# Altium schematic sheet POWER_SUPPLY.SchDoc: SG Sensor
size B; DocumentNumber: 5; SheetNumber: 2; SheetTotal: 4; PAGE_TITLE: Power Supply
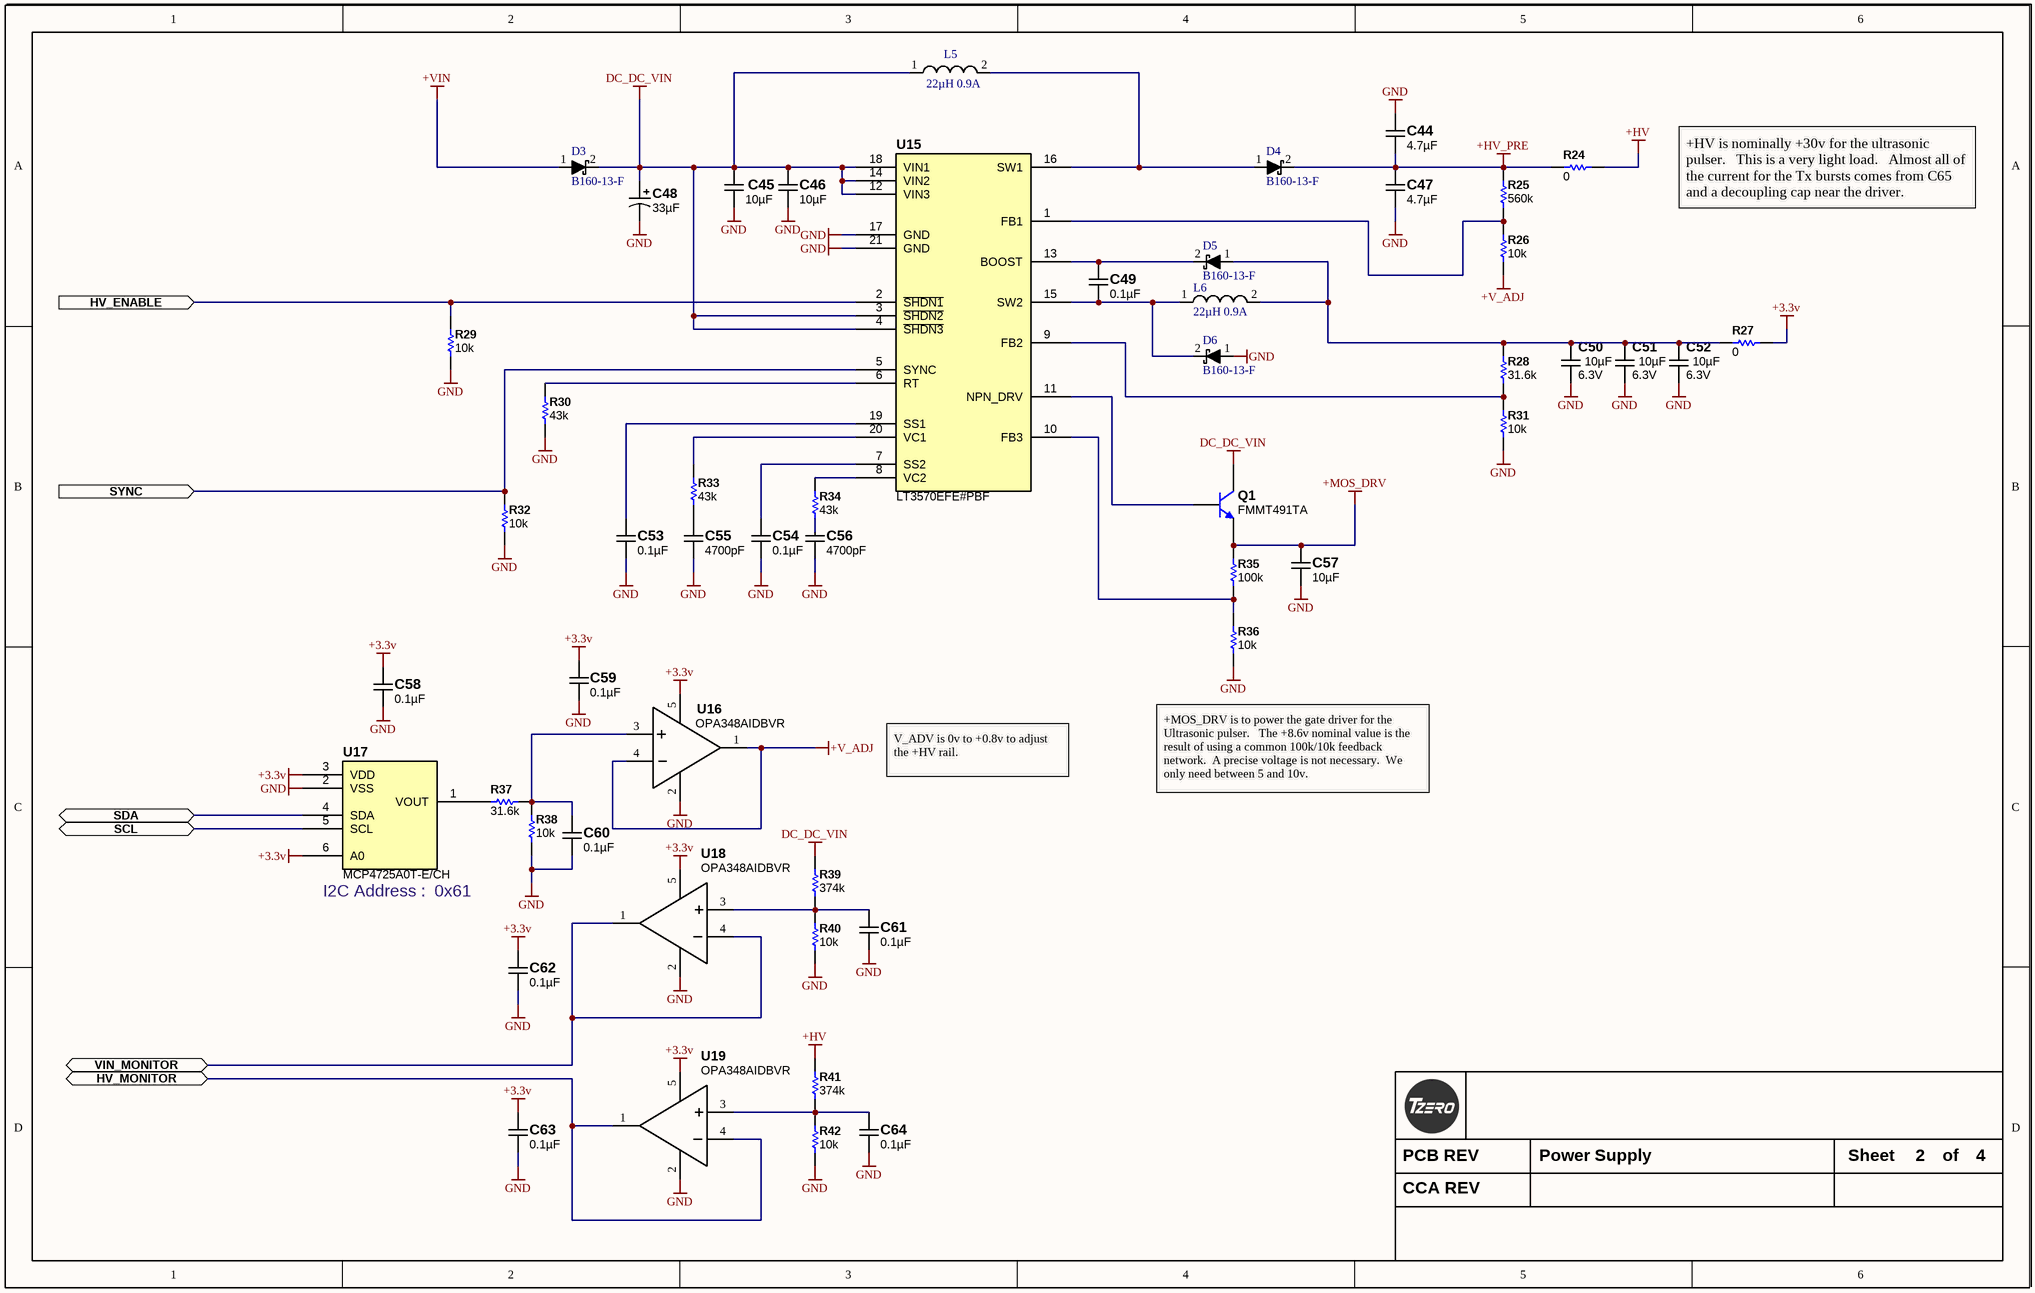
[diagram p0: POWER_SUPPLY.SchDoc]

## Parts
C44  4.7µF  [C1210_2.80MM_HD]
C45  10µF  [C1206_1.90MM_HD]
C46  10µF  [C1206_1.90MM_HD]
C47  4.7µF  [C1210_2.80MM_HD]
C48  33µF  [C_ALU_C]
C49  0.1µF  [C0603_0.90MM_HD]
C50  10µF  Voltage - Rated: 6.3V  [C0805_1.45MM_MD]
C51  10µF  Voltage - Rated: 6.3V  [C0805_1.45MM_MD]
C52  10µF  Voltage - Rated: 6.3V  [C0805_1.45MM_MD]
C53  0.1µF  [C0603_0.90MM_HD]
C54  0.1µF  [C0603_0.90MM_HD]
C55  4700pF  [C0603_0.95MM_HD]
C56  4700pF  [C0603_0.95MM_HD]
C57  10µF  [C1206_1.90MM_HD]
C58  0.1µF  [C0603_0.90MM_HD]
C59  0.1µF  [C0603_0.90MM_HD]
C60  0.1µF  [C0603_0.90MM_HD]
C61  0.1µF  [C0603_0.90MM_HD]
C62  0.1µF  [C0603_0.90MM_HD]
C63  0.1µF  [C0603_0.90MM_HD]
C64  0.1µF  [C0603_0.90MM_HD]
D3  B160-13-F  [D_SMA_P]
D4  B160-13-F  [D_SMA_P]
D5  B160-13-F  [D_SMA_P]
D6  B160-13-F  [D_SMA_P]
L5  22µH 0.9A  [L_NRS5020]
L6  22µH 0.9A  [L_NRS5020]
Q1  FMMT491TA  [SOT-23]
R24  0  [R0603_0.55MM_HD]
R25  560k  [R0603_0.55MM_HD]
R26  10k  [R0603_0.55MM_HD]
R27  0  [R0603_0.55MM_HD]
R28  31.6k  [R0603_0.55MM_HD]
R29  10k  [R0603_0.55MM_HD]
R30  43k  [R0603_0.55MM_HD]
R31  10k  [R0603_0.55MM_HD]
R32  10k  [R0603_0.55MM_HD]
R33  43k  [R0603_0.55MM_HD]
R34  43k  [R0603_0.55MM_HD]
R35  100k  [R0603_0.55MM_HD]
R36  10k  [R0603_0.55MM_HD]
R37  31.6k  [R0603_0.55MM_HD]
R38  10k  [R0603_0.55MM_HD]
R39  374k  [R0603_0.55MM_HD]
R40  10k  [R0603_0.55MM_HD]
R41  374k  [R0603_0.55MM_HD]
R42  10k  [R0603_0.55MM_HD]
U15  LT3570EFE#PBF  [TSOP65P640X120_HS-21N]
U16  OPA348AIDBVR  [SOT23-5]
U17  MCP4725A0T-E/CH  [SOT95P245X145-6L]
U18  OPA348AIDBVR  [SOT23-5]
U19  OPA348AIDBVR  [SOT23-5]

## Ports
HV_ENABLE (in), HV_MONITOR (bidir), SCL (bidir), SDA (bidir), SYNC (in), VIN_MONITOR (bidir)

## Nets
+3.3v: C58.2 C59.2 C62.2 C63.2 R27.1 U16.5(VCC) U17.3(VDD) U17.6(A0) U18.5(VCC) U19.5(VCC)
+HV: R24.1 R41.2
+HV_PRE: C44.1 C47.2 D4.2(K) R24.2 R25.2
+MOS_DRV: C57.2 Q1.2(E) R35.2
+V_ADJ: R26.1 U16.1(OUT) U16.4(-)
+VIN: D3.1(A)
DC_DC_VIN: C45.2 C46.2 C48.1 D3.2(K) L5.1 Q1.3(C) R39.2 U15.3(~{SHDN2}) U15.4(~{SHDN3}) U15.12(VIN3) U15.14(VIN2) U15.18(VIN1)
GND: C44.2 C45.1 C46.1 C47.1 C48.2 C50.1 C51.1 C52.1 C53.1 C54.1 C55.1 C56.1 C57.1 C58.1 C59.1 C60.1 C61.1 C62.1 C63.1 C64.1 D6.1(A) R29.1 R30.1 R31.1 R32.1 R36.1 R38.1 R40.1 R42.1 U15.17(GND) U15.21(GND) U16.2(GND) U17.2(VSS) U18.2(GND) U19.2(GND)
HV_ENABLE: R29.2 U15.2(~{SHDN1}) ; port HV_ENABLE
HV_MONITOR: U19.1(OUT) U19.4(-) ; port HV_MONITOR
SCL: U17.5(SCL) ; port SCL
SDA: U17.4(SDA) ; port SDA
SYNC: R32.2 U15.5(SYNC) ; port SYNC
VIN_MONITOR: U18.1(OUT) U18.4(-) ; port VIN_MONITOR
NetC49_1: C49.1 D6.2(K) L6.1 U15.15(SW2)
NetC49_2: C49.2 D5.2(K) U15.13(BOOST)
NetC50_2: C50.2 C51.2 C52.2 D5.1(A) L6.2 R27.2 R28.2
NetC53_2: C53.2 U15.19(SS1)
NetC54_2: C54.2 U15.7(SS2)
NetC55_2: C55.2 R33.1
NetC56_2: C56.2 R34.1
NetC60_2: C60.2 R37.1 R38.2 U16.3(+)
NetC61_2: C61.2 R39.1 R40.2 U18.3(+)
NetC64_2: C64.2 R41.1 R42.2 U19.3(+)
NetD4_1: D4.1(A) L5.2 U15.16(SW1)
NetQ1_1: Q1.1(B) U15.11(NPN_DRV)
NetR25_1: R25.1 R26.2 U15.1(FB1)
NetR28_1: R28.1 R31.2 U15.9(FB2)
NetR30_2: R30.2 U15.6(RT)
NetR33_2: R33.2 U15.20(VC1)
NetR34_2: R34.2 U15.8(VC2)
NetR35_1: R35.1 R36.2 U15.10(FB3)
NetR37_2: R37.2 U17.1(VOUT)

## Notes on the sheet
- +HV is nominally +30v for the ultrasonic pulser.   This is a very light load.   Almost all of the current for the Tx bursts comes from C65 and a decoupling cap near the driver.
- V_ADV is 0v to +0.8v to adjust the +HV rail.
- (near R36) +MOS_DRV is to power the gate driver for the Ultrasonic pulser.   The +8.6v nominal value is the result of using a common 100k/10k feedback network.  A precise voltage is not necessary.  We only need between 5 and 10v.
- (near U17) I2C Address :  0x61
- PCB REV
- Sheet
- of
- CCA REV

## Library data of the parts
C44 C47 = CGA6P3X7R1H475M250AB: CAP CER 4.7UF 50V X7R 1210; Manufacturer: TDK Corporation; Tolerance: ±20%; Substitution Notes: 4.7µF , 50V , ±20% , X7R , -55°C ~ 125°C , AEC-Q200 , 1210; Value: 4.7µF; Temperature Coefficient: X7R; Manufacturer Part Number: CGA6P3X7R1H475M250AB; ComponentLink1Description: Datasheet (Internal); ComponentLink1URL: datasheets\TDK\mlcc_automotive_general_en.pdf; ComponentLink2Description: Datasheet (External); ComponentLink2URL: https://product.tdk.com/info/en/catalog/datasheets/mlcc_automotive_general_en.pdf; Supplier 1: Digikey; Supplier Part Number 1: 445-13030-1-ND; Category: Capacitors; Voltage - Rated: 50V; Operating Temperature: -55°C ~ 125°C; Ratings: AEC-Q200; Package: 1210; Thickness (Max): 2.80MM; Features: -
C45 C46 C57 = CGA5L1X7R1V106K160AE: CAP CER 10UF 35V X7R 1206; Manufacturer: TDK Corporation; Tolerance: ±10%; Substitution Notes: 10µF , 35V , ±10% , X7R , -55°C ~ 125°C , AEC-Q200 , 1206; Value: 10µF; Temperature Coefficient: X7R; Manufacturer Part Number: CGA5L1X7R1V106K160AE; ComponentLink1Description: Datasheet (Internal); ComponentLink1URL: datasheets\TDK\mlcc_automotive_general_en.pdf; ComponentLink2Description: Datasheet (External); ComponentLink2URL: https://product.tdk.com/info/en/catalog/datasheets/mlcc_automotive_general_en.pdf; Supplier 1: Digikey; Supplier Part Number 1: 445-172483-1-ND; Category: Capacitors; Voltage - Rated: 35V; Operating Temperature: -55°C ~ 125°C; Ratings: AEC-Q200; Package: 1206; Thickness (Max): 1.90MM; Features: Soft Termination
C48 = EEE-FK1E330UR: CAP ALUM 33UF 25V 20% SMD; Manufacturer: Panasonic Electronic Components; Lifetime @ Temp#: 2000 Hrs @ 105°C; Ripple Current: 160mA; Impedance: 700 mOhm; Surface Mount Land Size: 0.209" L x 0.209" W (5.30mm x 5.30mm); F40: UR; Value_Voltage: 33µF  25V; Value: 33µF; Temperature Coefficient: Temperature Coefficient; Manufacturer Part Number: EEE-FK1E330UR; ComponentLink1Description: Internal Datasheet; ComponentLink1URL: http://industrial.panasonic.com/www-cgi/jvcr13pz.cgi?E+PZ+3+ABA0120+EEEFK1E330UR+7+WW; ComponentLink2Description: External Datasheet; ComponentLink2URL: http://industrial.panasonic.com/www-cgi/jvcr13pz.cgi?E+PZ+3+ABA0120+EEEFK1E330UR+7+WW; Stocked: 0; Supplier 1: Digi-Key; Supplier Part Number 1: PCE3802CT-ND; Category: Capacitors; Sort Value: 33000000; Sort Value Package: C_33000000; Pricing: 1 = 0.63  ;  50 = 0.3576  ;  100 = 0.298  ;  250 = 0.22348  ;  500 = 0.19072 (USD); Sales Status: Active; Capacitance: 33µF; Voltage Rating: 25V; Tolerance: ±20%; Operating Temperature: -55°C ~ 105°C; Features: General Purpose; ESR (Equivalent Series Resistance): -; Mounting Type: Surface Mount; Package / Case: Radial- Can - SMD; Size / Dimension: 0.197" Dia (5.00mm); Height - Seated (Max): 0.228" (5.80mm); Lead Spacing: -; Packaging: Cut Tape (CT); Diameter: 5.00; Height: 5.80; Package: C
C49 C53 C54 C58-C64 = CGA3E2X7R1H104K080AE: CAP CER 0.1UF 50V X7R 0603; Manufacturer: TDK Corporation; Tolerance: ±10%; Substitution Notes: 0.1µF , 50V , ±10% , X7R , -55°C ~ 125°C , AEC-Q200 , 0603; Value: 0.1µF; Temperature Coefficient: X7R; Manufacturer Part Number: CGA3E2X7R1H104K080AE; ComponentLink1Description: Datasheet (Internal); ComponentLink1URL: datasheets\TDK\mlcc_automotive_general_en.pdf; ComponentLink2Description: Datasheet (External); ComponentLink2URL: https://product.tdk.com/info/en/catalog/datasheets/mlcc_automotive_general_en.pdf; Supplier 1: Digikey; Supplier Part Number 1: 445-15957-1-ND; Category: Capacitors; Voltage - Rated: 50V; Operating Temperature: -55°C ~ 125°C; Ratings: AEC-Q200; Package: 0603; Thickness (Max): 0.90MM; Features: Soft Termination
C50-C52 = CGA4J1X7R0J106K125AC: CAP CER 10UF 6.3V X7R 0805; Manufacturer: TDK Corporation; Tolerance: ±10%; Substitution Notes: 10µF , 6.3V , ±10% , X7R , -55°C ~ 125°C , AEC-Q200 , 0805; Value: 10µF; Temperature Coefficient: X7R; Manufacturer Part Number: CGA4J1X7R0J106K125AC; ComponentLink1Description: Datasheet (Internal); ComponentLink1URL: datasheets\TDK\mlcc_automotive_general_en.pdf; ComponentLink2Description: Datasheet (External); ComponentLink2URL: https://product.tdk.com/info/en/catalog/datasheets/mlcc_automotive_general_en.pdf; Supplier 1: Digikey; Supplier Part Number 1: 445-6971-1-ND; Category: Capacitors; Features: -; Operating Temperature: -55°C ~ 125°C; Ratings: AEC-Q200; Package: 0805; Thickness (Max): 1.45MM
C55 C56 = CGA3E2X7R1H472K080AE: CAP CER 4700PF 50V X7R 0603; Manufacturer: TDK Corporation; Tolerance: ±10%; Substitution Notes: 4700pF , 50V , ±10% , X7R , -55°C ~ 125°C , AEC-Q200 , 0603; Value: 4700pF; Temperature Coefficient: X7R; Manufacturer Part Number: CGA3E2X7R1H472K080AE; ComponentLink1Description: Datasheet (Internal); ComponentLink1URL: datasheets\TDK\mlcc_automotive_general_en.pdf; ComponentLink2Description: Datasheet (External); ComponentLink2URL: https://product.tdk.com/info/en/catalog/datasheets/mlcc_automotive_general_en.pdf; Supplier 1: Digikey; Supplier Part Number 1: 445-173691-1-ND; Category: Capacitors; Voltage - Rated: 50V; Operating Temperature: -55°C ~ 125°C; Ratings: AEC-Q200; Package: 0603; Thickness (Max): 0.95MM; Features: Soft Termination
D3-D6 = B160-13-F: DIODE SCHOTTKY 60V 1A SMA; Manufacturer: Diodes Inc; CategorySort: 400; Voltage - Forward (Vf) (Max) @ If: 700mV @ 1A; Speed: Fast Recovery =< 500ns- > 200mA (Io); Current - Reverse Leakage @ Vr: 500µA @ 60V; Capacitance @ Vr- F: 110pF @ 4V- 1MHz; Num Pins: 2; Diode Suffix: 1A_2C; Category: Diodes; Value: B160-13-F; Manufacturer Part Number: B160-13-F; ComponentLink1Description: Internal Datasheet; ComponentLink1URL: http://www.diodes.com/datasheets/ds13002.pdf; ComponentLink2Description: External Datasheet; ComponentLink2URL: http://www.diodes.com/datasheets/ds13002.pdf; Supplier 1: Digi-Key; Supplier Part Number 1: B160-FDICT-ND; SortValue: B160-13-F; Diode Type: Schottky; Voltage - DC Reverse (Vr) (Max): 60V; Current - Average Rectified (Io): 1A; Reverse Recovery Time (trr): -; Mounting Type: Surface Mount; Package: DO-214AC- SMA; Supplier Device Package: SMA; Packaging: Cut Tape (CT)
L5 L6 = NRS5020T220MMGJ: Inductor 22µH 0.9A; Manufacturer: Taiyo Yuden; CategorySort: 300; Inductance (uH): 22; Tolerance: ±20%; DCR Max (Ohms): 312 mOhm Max; SRF typ (MHz): 17MHz; Isat (A): 0.9; IRMS: 1; Shielding: Sheilded; Category: Inductors; Value: 22µH 0.9A; Part Number: NRS5020T220MMGJ; ComponentLink1Description: External Datasheet; ComponentLink1URL: http://ds.yuden.co.jp/TYCOMPAS/ut/detail.do?productNo=NRS5020T220MMGJV&fileName=NRS5020T220MMGJV_SS&mode=specSheetDownload; Sort Value: 22_0.9; Sort Value Package: 22_0.9_NRS5020; Manufacturer Part Number: NRS5020T220MMGJ; Supplier 1: Digikey; Supplier Part Number 1: 587-2411-1-ND; Supplier Unit Price 1: 0.34; Package: NRS5020; Height (mm): 2mm; Rating: -
Q1 = FMMT491TA: TRANS NPN 60V 1A SOT23-3; Manufacturer: Diodes Zetex; Max Power Dissipation: 500mW; Collector Base Voltage (VCBO): 80V; hFE Min: 100; Number of Elements: 1; Frequency: 150MHz; Emitter Base Voltage (VEBO): 5V; Collector Emitter Saturation Voltage: 160mV; Element Configuration: Single; Value: FMMT491TA; Supplier 1: Digi-Key; Manufacturer Part Number: FMMT491TA; Stock 1: 30887; Pricing 1: 1=0.49, 10=0.399, 100=0.2719, 500=0.20394, 1000=0.15296 (USD); Mount: Surface Mount; Case/Package: SOT-23; Number of Pins: 3; Weight: 0.000282oz; Min Operating Temperature: -55°C; Max Operating Temperature: 150°C; Collector Emitter Voltage (VCEO): 60V; Max Collector Current: 1A; Package Quantity: 3000; Packaging: Tape and Reel; Transition Frequency: 150MHz; Collector Emitter Breakdown Voltage: 60V; Max Breakdown Voltage: 60V; Polarity: NPN; Continuous Collector Current: 1A; Termination: SMD/SMT; Power Dissipation: 500mW; Max Frequency: 150MHz; Gain Bandwidth Product: 150MHz; Voltage Rating (DC): 60V; Current Rating: 1A; Length: 3.04mm; Height: 1.02mm; Width: 1.4mm; Radiation Hardening: No; REACH SVHC: No SVHC; Lead Free: Lead Free; ComponentLink1URL: https://datasheet.ciiva.com/974/fmmt491-974176.pdf; ComponentLink1Description: https://datasheet.ciiva.com/974/fmmt491-974176.pdf; ComponentLink2URL: https://datasheet.ciiva.com/5782/313018-5782560.pdf; ComponentLink2Description: https://datasheet.ciiva.com/5782/313018-5782560.pdf; ComponentLink3URL: https://datasheet.ciiva.com/974/fmmt491-974177.pdf; ComponentLink3Description: https://datasheet.ciiva.com/974/fmmt491-974177.pdf; ComponentLink4URL: https://datasheet.ciiva.com/974/fmmt491-974178.pdf; ComponentLink4Description: https://datasheet.ciiva.com/974/fmmt491-974178.pdf; ComponentLink5URL: https://datasheet.ciiva.com/11198/fmmt491-11198278.pdf; ComponentLink5Description: https://datasheet.ciiva.com/11198/fmmt491-11198278.pdf; ComponentLink6URL: https://datasheet.ciiva.com/16211/fmmt491-16211079.pdf; ComponentLink6Description: https://datasheet.ciiva.com/16211/fmmt491-16211079.pdf; ComponentLink7URL: https://datasheet.ciiva.com/15139/getdatasheetpartid-76595-15139033.pdf; ComponentLink7Description: https://datasheet.ciiva.com/15139/getdatasheetpartid-76595-15139033.pdf; ComponentLink8URL: https://datasheet.ciiva.com/4723/fmmt491-4723531.pdf; ComponentLink8Description: https://datasheet.ciiva.com/4723/fmmt491-4723531.pdf; ComponentLink9URL: https://datasheet.ciiva.com/8029/313018-8029549.pdf; ComponentLink9Description: https://datasheet.ciiva.com/8029/313018-8029549.pdf; ComponentLink10URL: https://datasheet.ciiva.com/16614/fmmt491-16614670.pdf; ComponentLink10Description: https://datasheet.ciiva.com/16614/fmmt491-16614670.pdf; ComponentLink11URL: https://datasheet.ciiva.com/5782/313018-5782559.pdf; ComponentLink11Description: https://datasheet.ciiva.com/5782/313018-5782559.pdf; Supplier Part Number 1: FMMT491CT-ND
R24 R27 = ERJ-3GEY0R00V: RES 0.0 OHM 1/10W JUMP 0603 SMD; Manufacturer: Panasonic Electronic Components; Package Power: 0603  (0.1W); Power (Watts): 0.1W- 1/10W; Tolerance: Jumper; Limiting Element Voltage: 75; Maximum Overload Voltage: 150; Maximum Working Voltage: 0.0V; Substitution Notes: 0 , Jumper , 0603 , AEC-Q200; Value: 0; Manufacturer Part Number: ERJ-3GEY0R00V; ComponentLink1Description: Internal Datasheet; ComponentLink1URL: datasheets\Panasonic Electronic Components\AOA0000CE1.pdf; ComponentLink2Description: External Datasheet; ComponentLink2URL: http://industrial.panasonic.com/www-data/pdf/AOA0000/AOA0000CE1.pdf; Supplier 1: Digi-Key; Supplier Part Number 1: P0.0GCT-ND; Category: Resistors; Resistance (Ohms): 0; Composition: Thick Film; Features: -; Temperature Coefficient: -; Package: 0603 (1608 Metric); Supplier Package: 0603; Size / Dimension: 0.063" L x 0.031" W (1.60mm x 0.80mm); Height: 0.55MM; Number of Terminations: 2; Sort Value: 0; Sort Value Package: 603_0; Ratings: AEC-Q200
R25 = ERJ-3EKF5603V: RES 560K OHM 1/10W 1% 0603 SMD; Manufacturer: Panasonic Electronic Components; Package Power: 0603  (0.1W); Power (Watts): 0.1W- 1/10W; Temperature Coefficient: ±100ppm/°C; Limiting Element Voltage: 75; Maximum Overload Voltage: 150; Maximum Working Voltage: 75.0V; Substitution Notes: 560k , ±1% , 0603 , AEC-Q200; Value: 560k; Manufacturer Part Number: ERJ-3EKF5603V; ComponentLink1Description: Internal Datasheet; ComponentLink1URL: datasheets\Panasonic Electronic Components\AOA0000CE2.pdf; ComponentLink2Description: External Datasheet; ComponentLink2URL: http://industrial.panasonic.com/www-data/pdf/AOA0000/AOA0000CE2.pdf; Supplier 1: Digi-Key; Supplier Part Number 1: P560KHCT-ND; Category: Resistors; Resistance (Ohms): 560k; Composition: Thick Film; Features: -; Tolerance: ±1%; Package: 0603 (1608 Metric); Supplier Package: 0603; Size / Dimension: 0.063" L x 0.031" W (1.60mm x 0.80mm); Height: 0.55MM; Number of Terminations: 2; Packaging: Cut Tape (CT); Sort Value: 560000; Sort Value Package: 603_560000; Ratings: AEC-Q200
R26 R29 R31 R32 R36 R38 R40 R42 = ERJ-3EKF1002V: RES 10K OHM 1/10W 1% 0603 SMD; Manufacturer: Panasonic Electronic Components; Package Power: 0603  (0.1W); Power (Watts): 0.1W- 1/10W; Temperature Coefficient: ±100ppm/°C; Limiting Element Voltage: 75; Maximum Overload Voltage: 150; Maximum Working Voltage: 31.6V; Substitution Notes: 10k , ±1% , 0603 , AEC-Q200; Value: 10k; Manufacturer Part Number: ERJ-3EKF1002V; ComponentLink1Description: Internal Datasheet; ComponentLink1URL: datasheets\Panasonic Electronic Components\AOA0000CE2.pdf; ComponentLink2Description: External Datasheet; ComponentLink2URL: http://industrial.panasonic.com/www-data/pdf/AOA0000/AOA0000CE2.pdf; Supplier 1: Digi-Key; Supplier Part Number 1: P10.0KHCT-ND; Category: Resistors; Resistance (Ohms): 10k; Composition: Thick Film; Features: -; Tolerance: ±1%; Package: 0603 (1608 Metric); Supplier Package: 0603; Size / Dimension: 0.063" L x 0.031" W (1.60mm x 0.80mm); Height: 0.55MM; Number of Terminations: 2; Packaging: Cut Tape (CT); Sort Value: 10000; Sort Value Package: 603_10000; Ratings: AEC-Q200
R28 R37 = ERJ-3EKF3162V: RES 31.6K OHM 1/10W 1% 0603 SMD; Manufacturer: Panasonic Electronic Components; Package Power: 0603  (0.1W); Power (Watts): 0.1W- 1/10W; Temperature Coefficient: ±100ppm/°C; Limiting Element Voltage: 75; Maximum Overload Voltage: 150; Maximum Working Voltage: 56.2V; Substitution Notes: 31.6k , ±1% , 0603 , AEC-Q200; Value: 31.6k; Manufacturer Part Number: ERJ-3EKF3162V; ComponentLink1Description: Internal Datasheet; ComponentLink1URL: datasheets\Panasonic Electronic Components\AOA0000CE2.pdf; ComponentLink2Description: External Datasheet; ComponentLink2URL: http://industrial.panasonic.com/www-data/pdf/AOA0000/AOA0000CE2.pdf; Supplier 1: Digi-Key; Supplier Part Number 1: P31.6KHCT-ND; Category: Resistors; Resistance (Ohms): 31.6k; Composition: Thick Film; Features: -; Tolerance: ±1%; Package: 0603 (1608 Metric); Supplier Package: 0603; Size / Dimension: 0.063" L x 0.031" W (1.60mm x 0.80mm); Height: 0.55MM; Number of Terminations: 2; Packaging: Cut Tape (CT); Sort Value: 31600; Sort Value Package: 603_31600; Ratings: AEC-Q200
R30 R33 R34 = ERJ-3EKF4302V: RES 43K OHM 1/10W 1% 0603 SMD; Manufacturer: Panasonic Electronic Components; Package Power: 0603  (0.1W); Power (Watts): 0.1W- 1/10W; Temperature Coefficient: ±100ppm/°C; Limiting Element Voltage: 75; Maximum Overload Voltage: 150; Maximum Working Voltage: 65.6V; Substitution Notes: 43k , ±1% , 0603 , AEC-Q200; Value: 43k; Manufacturer Part Number: ERJ-3EKF4302V; ComponentLink1Description: Internal Datasheet; ComponentLink1URL: datasheets\Panasonic Electronic Components\AOA0000CE2.pdf; ComponentLink2Description: External Datasheet; ComponentLink2URL: http://industrial.panasonic.com/www-data/pdf/AOA0000/AOA0000CE2.pdf; Supplier 1: Digi-Key; Supplier Part Number 1: P43.0KHCT-ND; Category: Resistors; Resistance (Ohms): 43k; Composition: Thick Film; Features: -; Tolerance: ±1%; Package: 0603 (1608 Metric); Supplier Package: 0603; Size / Dimension: 0.063" L x 0.031" W (1.60mm x 0.80mm); Height: 0.55MM; Number of Terminations: 2; Packaging: Cut Tape (CT); Sort Value: 43000; Sort Value Package: 603_43000; Ratings: AEC-Q200
R35 = ERJ-3EKF1003V: RES 100K OHM 1/10W 1% 0603 SMD; Manufacturer: Panasonic Electronic Components; Package Power: 0603  (0.1W); Power (Watts): 0.1W- 1/10W; Temperature Coefficient: ±100ppm/°C; Limiting Element Voltage: 75; Maximum Overload Voltage: 150; Maximum Working Voltage: 75.0V; Substitution Notes: 100k , ±1% , 0603 , AEC-Q200; Value: 100k; Manufacturer Part Number: ERJ-3EKF1003V; ComponentLink1Description: Internal Datasheet; ComponentLink1URL: datasheets\Panasonic Electronic Components\AOA0000CE2.pdf; ComponentLink2Description: External Datasheet; ComponentLink2URL: http://industrial.panasonic.com/www-data/pdf/AOA0000/AOA0000CE2.pdf; Supplier 1: Digi-Key; Supplier Part Number 1: P100KHCT-ND; Category: Resistors; Resistance (Ohms): 100k; Composition: Thick Film; Features: -; Tolerance: ±1%; Package: 0603 (1608 Metric); Supplier Package: 0603; Size / Dimension: 0.063" L x 0.031" W (1.60mm x 0.80mm); Height: 0.55MM; Number of Terminations: 2; Packaging: Cut Tape (CT); Sort Value: 100000; Sort Value Package: 603_100000; Ratings: AEC-Q200
R39 R41 = ERJ-3EKF3743V: RES 374K OHM 1/10W 1% 0603 SMD; Manufacturer: Panasonic Electronic Components; Package Power: 0603  (0.1W); Power (Watts): 0.1W- 1/10W; Temperature Coefficient: ±100ppm/°C; Limiting Element Voltage: 75; Maximum Overload Voltage: 150; Maximum Working Voltage: 75.0V; Substitution Notes: 374k , ±1% , 0603 , AEC-Q200; Value: 374k; Manufacturer Part Number: ERJ-3EKF3743V; ComponentLink1Description: Internal Datasheet; ComponentLink1URL: datasheets\Panasonic Electronic Components\AOA0000CE2.pdf; ComponentLink2Description: External Datasheet; ComponentLink2URL: http://industrial.panasonic.com/www-data/pdf/AOA0000/AOA0000CE2.pdf; Supplier 1: Digi-Key; Supplier Part Number 1: P374KHCT-ND; Category: Resistors; Resistance (Ohms): 374k; Composition: Thick Film; Features: -; Tolerance: ±1%; Package: 0603 (1608 Metric); Supplier Package: 0603; Size / Dimension: 0.063" L x 0.031" W (1.60mm x 0.80mm); Height: 0.55MM; Number of Terminations: 2; Packaging: Cut Tape (CT); Sort Value: 374000; Sort Value Package: 603_374000; Ratings: AEC-Q200
U15 = LT3570EFE#PBF: IC REG BUCK/BST/LINEAR 20TSSOP; Manufacturer: Linear Technology; Number of Outputs: 2; Max Input Voltage: 36V; Min Input Voltage: 2.5V; Switching Frequency: 2.1MHz; Voltage - Output 1: 800mV; Output Current: 1.5A; Frequency: 3MHz; Value: LT3570EFE#PBF; Supplier 1: Arrow; Supplier Part Number 1: LT3570EFE#PBF; Manufacturer Part Number: LT3570EFE#PBF; Stock 1: 2204; Pricing 1: 1=4.36, 99=3.7 (USD); Case/Package: TSSOP; Number of Pins: 20; Min Operating Temperature: -40°C; Max Operating Temperature: 125°C; Package Quantity: 74; Packaging: Rail/Tube; Voltage - Output 2: 800mV; Output Voltage: 800mV; Max Output Current: 1.5A; Max Supply Voltage: 36V; Min Supply Voltage: 2.5V; Min Output Voltage: 800mV; Termination: SMD/SMT; Radiation Hardening: No; Lead Free: Lead Free; REACH SVHC: No SVHC; ComponentLink1URL: https://datasheet.ciiva.com/2076/26936-2076065.pdf; ComponentLink1Description: https://datasheet.ciiva.com/2076/26936-2076065.pdf; ComponentLink2URL: https://datasheet.ciiva.com/6192/1692490-6192694.pdf; ComponentLink2Description: https://datasheet.ciiva.com/6192/1692490-6192694.pdf; ComponentLink3URL: https://datasheet.ciiva.com/7363/1692490-7363821.pdf; ComponentLink3Description: https://datasheet.ciiva.com/7363/1692490-7363821.pdf; ComponentLink4URL: https://datasheet.ciiva.com/7905/1692490-7905870.pdf; ComponentLink4Description: https://datasheet.ciiva.com/7905/1692490-7905870.pdf
U16 U18 U19 = OPA348AIDBVR: IC OPAMP GP 1MHZ RRO SOT23-5; Manufacturer: Texas Instruments; Min Supply Voltage: 2.5V; Max Supply Voltage: 5.5V; Voltage Gain: 108dB; Common Mode Rejection Ratio: 70dB; Number of Channels: 1; Slew Rate: 0.5V/µs; Nominal Supply Current: 65uA; Input Offset Voltage (Vos): 5mV; Input Bias Current: 10pA; Power Supply Rejection Ratio (PSRR): 84.44dB; Operating Supply Current: 45uA; Output Current per Channel: 10mA; Value: OPA348AIDBVR; Supplier 1: Digi-Key; Supplier Part Number 1: 296-26277-1-ND; Manufacturer Part Number: OPA348AIDBVR; Stock 1: 13530; Pricing 1: 1=0.68, 10=0.598, 100=0.4586, 500=0.36256, 1000=0.29005 (USD); Case/Package: SOT-23; Number of Pins: 5; Min Operating Temperature: -40°C; Max Operating Temperature: 125°C; Gain Bandwidth Product: 1MHz; Package Quantity: 3000; Packaging: Tape and Reel; Unity Gain Bandwidth Product: 1MHz; Bandwidth: 1MHz; Number of Circuits: 1; Number of Elements: 1; Number of Amplifiers: 1; Length: 2.9mm; Height: 1.15mm; Width: 1.6mm; Radiation Hardening: No; REACH SVHC: No SVHC; Lead Free: Lead Free; ComponentLink1URL: https://datasheet.ciiva.com/2974/opa4348-2974011.pdf; ComponentLink1Description: https://datasheet.ciiva.com/2974/opa4348-2974011.pdf; ComponentLink2URL: https://datasheet.ciiva.com/2974/opa4348-2974012.pdf; ComponentLink2Description: https://datasheet.ciiva.com/2974/opa4348-2974012.pdf; ComponentLink3URL: https://datasheet.ciiva.com/1811/opa2348-1811421.pdf; ComponentLink3Description: https://datasheet.ciiva.com/1811/opa2348-1811421.pdf; ComponentLink4URL: https://datasheet.ciiva.com/26226/opa4348-26226685.pdf; ComponentLink4Description: https://datasheet.ciiva.com/26226/opa4348-26226685.pdf; ComponentLink5URL: https://datasheet.ciiva.com/1811/opa2348-1811422.pdf; ComponentLink5Description: https://datasheet.ciiva.com/1811/opa2348-1811422.pdf; ComponentLink6URL: https://datasheet.ciiva.com/1811/opa2348-1811423.pdf; ComponentLink6Description: https://datasheet.ciiva.com/1811/opa2348-1811423.pdf; Contact Plating: Gold; Nominal Gain Bandwidth Product: 1MHz; Max I/O Voltage: 5mV
U17 = MCP4725A0T-E/CH: IC DAC 12BIT W/I2C SOT23A-6; Manufacturer: Microchip; Resolution: 12b; Integral Nonlinearity (INL): 14.5LSB; Output Type: Voltage; Number of DAC Channels: 1; Interface: I2C,Serial,2-Wire; Max Supply Voltage: 5.5V; Min Supply Voltage: 2.7V; Settling Time: 6us; Number of Bits: 12; Polarity: Unipolar; Supply Type: Single; Nominal Supply Current: 210uA; Input Offset Voltage (Vos): 1.1mV; Value: MCP4725A0T-E/CH; Supplier 1: Digi-Key; Supplier Part Number 1: MCP4725A0T-E/CHDKR-ND; Manufacturer Part Number: MCP4725A0T-E/CH; Stock 1: 42678; Pricing 1: 1=1.02, 25=0.848, 100=0.7738 (USD); Mount: Surface Mount; Case/Package: SOT-23-6; Number of Pins: 6; Contact Plating: Tin,Matte; Min Operating Temperature: -40°C; Max Operating Temperature: 125°C; Number of Channels: 1; Packaging: Tape and Reel; Package Quantity: 3000; Number of Converters: 1; Number of Outputs: 1; Number of D/A Converters: 1; Termination: SMD/SMT; Length: 3.1mm; Height: 1.3mm; Width: 1.8mm; Radiation Hardening: No; REACH SVHC: No SVHC; Lead Free: Lead Free; ComponentLink1URL: https://datasheet.ciiva.com/7660/1470577-7660741.pdf; ComponentLink1Description: https://datasheet.ciiva.com/7660/1470577-7660741.pdf; ComponentLink2URL: https://datasheet.ciiva.com/16355/filehandler-aspxddocname-en532676-16355109.pdf; ComponentLink2Description: https://datasheet.ciiva.com/16355/filehandler-aspxddocname-en532676-16355109.pdf; ComponentLink3URL: https://datasheet.ciiva.com/8169/22039c-8169286.pdf; ComponentLink3Description: https://datasheet.ciiva.com/8169/22039c-8169286.pdf; ComponentLink4URL: https://datasheet.ciiva.com/12285/22039c-78124-12285942.pdf; ComponentLink4Description: https://datasheet.ciiva.com/12285/22039c-78124-12285942.pdf; ComponentLink5URL: https://datasheet.ciiva.com/16625/22039c-16625638.pdf; ComponentLink5Description: https://datasheet.ciiva.com/16625/22039c-16625638.pdf; ComponentLink6URL: https://datasheet.ciiva.com/26947/getdatasheetpartid-780909-26947786.pdf; ComponentLink6Description: https://datasheet.ciiva.com/26947/getdatasheetpartid-780909-26947786.pdf; ComponentLink7URL: https://datasheet.ciiva.com/1359/22039d-1359787.pdf; ComponentLink7Description: https://datasheet.ciiva.com/1359/22039d-1359787.pdf; ComponentLink8URL: https://datasheet.ciiva.com/1359/22039d-1359788.pdf; ComponentLink8Description: https://datasheet.ciiva.com/1359/22039d-1359788.pdf; ComponentLink9URL: https://datasheet.ciiva.com/1359/22039d-1359789.pdf; ComponentLink9Description: https://datasheet.ciiva.com/1359/22039d-1359789.pdf; ComponentLink10URL: https://datasheet.ciiva.com/14180/mcp4725-eng-tds-14180126.pdf; ComponentLink10Description: https://datasheet.ciiva.com/14180/mcp4725-eng-tds-14180126.pdf